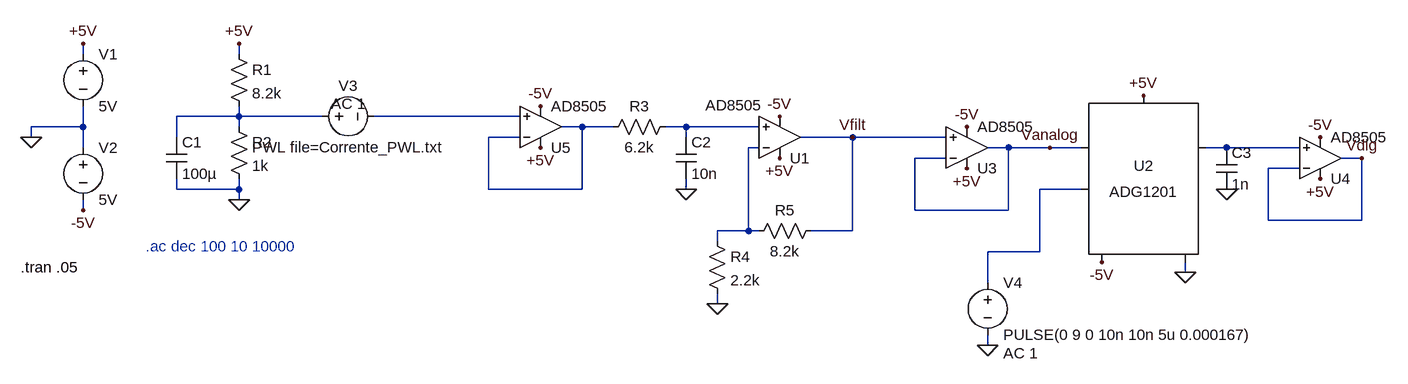
[diagram p0: schematic Av1c.asc]
Av1c.asc, the LTspice schematic file:
Version 4
SHEET 1 1632 680
WIRE -384 -224 -384 -240
WIRE -144 -224 -144 -240
WIRE -144 -128 -144 -144
WIRE -144 -128 -240 -128
WIRE -16 -128 -144 -128
WIRE 288 -128 64 -128
WIRE -384 -112 -384 -144
WIRE -384 -112 -464 -112
WIRE -144 -112 -144 -128
WIRE 384 -112 352 -112
WIRE 432 -112 384 -112
WIRE 544 -112 512 -112
WIRE 656 -112 544 -112
WIRE -464 -96 -464 -112
WIRE -240 -96 -240 -128
WIRE 288 -96 240 -96
WIRE 544 -96 544 -112
WIRE 800 -96 720 -96
WIRE 944 -96 800 -96
WIRE -384 -80 -384 -112
WIRE 656 -80 640 -80
WIRE 1040 -80 1008 -80
WIRE 1104 -80 1040 -80
WIRE 1152 -80 1104 -80
WIRE 1376 -80 1344 -80
WIRE 1488 -80 1376 -80
WIRE 944 -64 896 -64
WIRE 1584 -64 1552 -64
WIRE 1488 -48 1440 -48
WIRE -240 -16 -240 -32
WIRE -144 -16 -144 -32
WIRE -144 -16 -240 -16
WIRE 240 -16 240 -96
WIRE 384 -16 384 -112
WIRE 384 -16 240 -16
WIRE 544 -16 544 -32
WIRE 1152 -16 1088 -16
WIRE -144 0 -144 -16
WIRE -384 16 -384 0
WIRE 896 16 896 -64
WIRE 1040 16 1040 -80
WIRE 1040 16 896 16
WIRE 1440 32 1440 -48
WIRE 1584 32 1584 -64
WIRE 1584 32 1440 32
WIRE 640 48 640 -80
WIRE 640 48 592 48
WIRE 656 48 640 48
WIRE 800 48 800 -96
WIRE 800 48 736 48
WIRE 592 64 592 48
WIRE 1088 80 1088 -16
WIRE 1088 80 1008 80
WIRE 1312 112 1312 96
WIRE 1008 128 1008 80
WIRE 592 160 592 144
WIRE 1008 224 1008 208
FLAG -464 -96 0
FLAG -384 -240 +5V
FLAG -384 16 -5V
FLAG -144 0 0
FLAG -144 -240 +5V
FLAG 544 -16 0
FLAG 592 160 0
FLAG 688 -128 -5V
FLAG 688 -64 +5V
FLAG 800 -96 Vfilt
FLAG 1248 -160 +5V
FLAG 1184 96 -5V
FLAG 976 -112 -5V
FLAG 976 -48 +5V
FLAG 1312 112 0
FLAG 1008 224 0
FLAG 1520 -96 -5V
FLAG 1520 -32 +5V
FLAG 1376 -16 0
FLAG 320 -144 -5V
FLAG 320 -80 +5V
FLAG 1584 -64 Vdig
FLAG 1104 -80 Vanalog
SYMBOL voltage -384 -240 R0
WINDOW 123 0 0 Left 0
WINDOW 39 0 0 Left 0
SYMATTR InstName V1
SYMATTR Value 5V
SYMBOL voltage -384 -96 R0
WINDOW 123 0 0 Left 0
WINDOW 39 0 0 Left 0
SYMATTR InstName V2
SYMATTR Value 5V
SYMBOL res -160 -240 R0
SYMATTR InstName R1
SYMATTR Value 8.2k
SYMBOL res -160 -128 R0
SYMATTR InstName R2
SYMATTR Value 1k
SYMBOL cap -256 -96 R0
SYMATTR InstName C1
SYMATTR Value 100µ
SYMBOL voltage -32 -128 R270
WINDOW 0 32 56 VTop 2
WINDOW 3 -32 56 VBottom 2
WINDOW 123 4 56 VTop 2
WINDOW 39 0 0 Left 0
SYMATTR InstName V3
SYMATTR Value PWL file=Corrente_PWL.txt
SYMATTR Value2 AC 1
SYMBOL OpAmps\\AD8505 688 -32 M180
WINDOW 3 -114 113 Left 2
SYMATTR InstName U1
SYMBOL res 528 -128 R90
WINDOW 0 0 56 VBottom 2
WINDOW 3 32 56 VTop 2
SYMATTR InstName R3
SYMATTR Value 6.2k
SYMBOL cap 528 -96 R0
SYMATTR InstName C2
SYMATTR Value 10n
SYMBOL res 752 32 R90
WINDOW 0 0 56 VBottom 2
WINDOW 3 32 56 VTop 2
SYMATTR InstName R5
SYMATTR Value 8.2k
SYMBOL res 576 48 R0
SYMATTR InstName R4
SYMATTR Value 2.2k
SYMBOL Switches\\ADG1201 1248 -32 R0
SYMATTR InstName U2
SYMBOL OpAmps\\AD8505 976 -16 M180
SYMATTR InstName U3
SYMBOL voltage 1008 112 R0
WINDOW 123 24 124 Left 2
WINDOW 39 0 0 Left 0
SYMATTR InstName V4
SYMATTR Value PULSE(0 9 0 10n 10n 5u 0.000167)
SYMATTR Value2 AC 1
SYMBOL OpAmps\\AD8505 1520 0 M180
SYMATTR InstName U4
SYMBOL cap 1360 -80 R0
SYMATTR InstName C3
SYMATTR Value 1n
SYMBOL OpAmps\\AD8505 320 -48 M180
SYMATTR InstName U5
TEXT -480 104 Left 2 !.tran .05
TEXT -288 72 Left 2 ;.ac dec 100 10 10000

The netlist it stands for:
* Av1c.asc
V1 +5V 0 5V
V2 0 -5V 5V
R1 +5V N001 8.2k
R2 N001 0 1k
C1 N001 0 100µ
V3 N001 N002 PWL file=Corrente_PWL.txt AC 1
XU1 N004 N005 +5V -5V Vfilt AD8505  ; pins In+ In- V+ V- OUT
R3 N004 N003 6.2k
C2 N004 0 10n
R5 Vfilt N005 8.2k
R4 N005 0 2.2k
XU2 N007 N006 Vanalog -5V 0 +5V ADG1201
XU3 Vfilt Vanalog +5V -5V Vanalog AD8505  ; pins In+ In- V+ V- OUT
V4 N007 0 PULSE(0 9 0 10n 10n 5u 0.000167) AC 1
XU4 N006 Vdig +5V -5V Vdig AD8505  ; pins In+ In- V+ V- OUT
C3 N006 0 1n
XU5 N002 N003 +5V -5V N003 AD8505  ; pins In+ In- V+ V- OUT
.tran .05
* .ac dec 100 10 10000
.lib ADG1201.sub
.backanno
.end